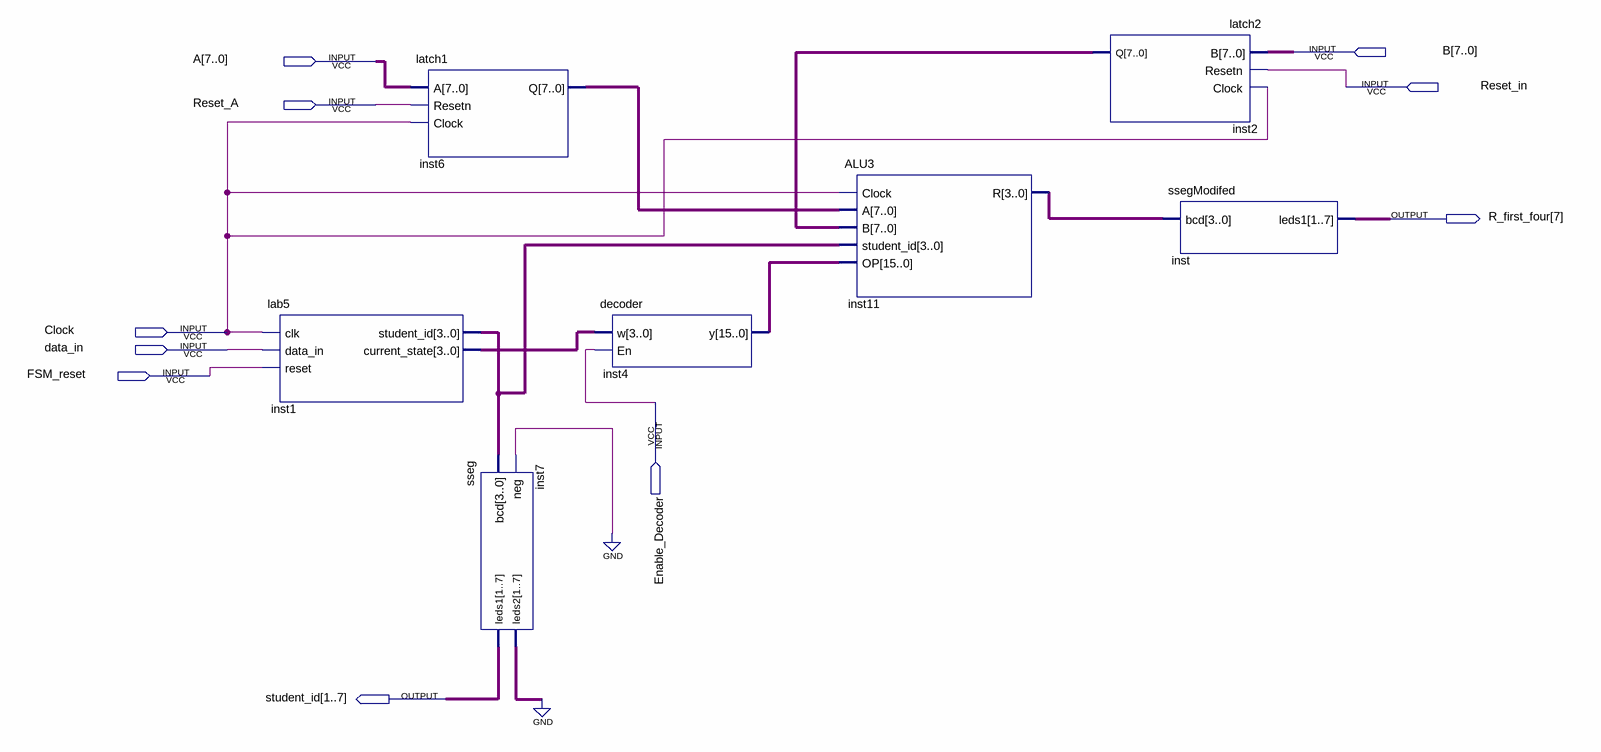
[diagram p0: schematic sheet]
// Quartus schematic ALU1.bdf as structural Verilog: 7 symbols, 10 pins
module ALU1 (
  input  [7:0] B,
  input  [7:0] A,
  input  Reset_in,
  input  Reset_A,
  input  Clock,
  input  data_in,
  input  FSM_reset,
  input  Enable_Decoder,
  output [7:7] R_first_four,
  output [1:7] student_id
);

  wire [3:0] inst1_current_state, inst1_student_id, inst11_r;
  wire [6:0] inst7_leds2, inst_leds1;
  wire [7:0] inst2_q, inst6_q;
  wire [15:0] inst4_y;

  lab5 inst1 (
    .clk(Clock), .data_in(data_in), .reset(FSM_reset), .student_id(inst1_student_id),
    .current_state(inst1_current_state));
  latch1 inst6 (.A(A), .Resetn(Reset_A), .Clock(Clock), .Q(inst6_q));
  sseg inst7 (.bcd(inst1_student_id), .neg(1'b0), .leds1(student_id), .leds2(inst7_leds2));
  decoder inst4 (.w(inst1_current_state), .En(Enable_Decoder), .y(inst4_y));
  ALU3 inst11 (.Clock(Clock), .A(inst6_q), .B(inst2_q), .student_id(inst1_student_id), .OP(inst4_y), .R(inst11_r));
  latch2 inst2 (.B(B), .Resetn(Reset_in), .Clock(Clock), .Q(inst2_q));
  ssegModifed inst (.bcd(inst11_r), .leds1(inst_leds1));
  // also tied to GND on the sheet: {inst7_leds2[0], inst7_leds2[1], inst7_leds2[2], inst7_leds2[3], inst7_leds2[4], inst7_leds2[5], inst7_leds2[6]}
endmodule
